# EAGLE design headstageNano (EAGLE 7.3.0)
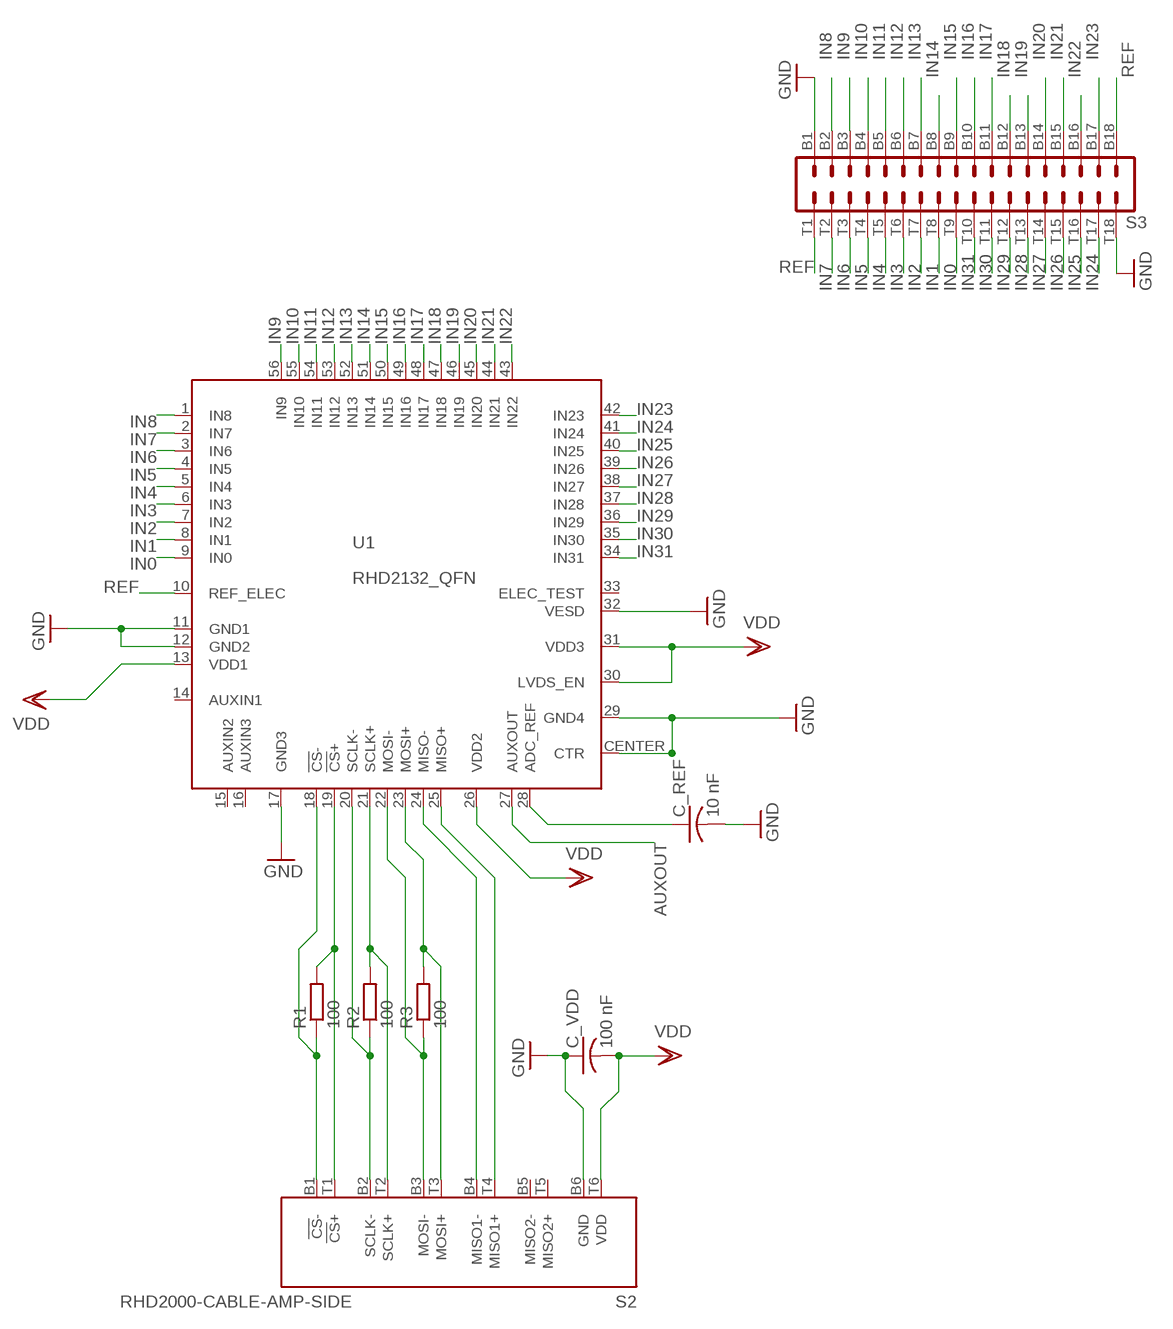
[diagram p0: schematic, sheet 1]

## Parts
C_REF  10 nF  C-USC0402K  [C0402K]
C_VDD  100 nF  C-USC0402K  [C0402K]
R1  100  R-EU_R0402  [R0402]
R2  100  R-EU_R0402  [R0402]
R3  100  R-EU_R0402  [R0402]
S2  RHD2000-CABLE-AMP-SIDE  [OMNETICS_PZN-12-AA]
S3  OMNETICS_A79025  [OMNETICS_A79025]
U1  RHD2132_QFN  [QFN56_8_X_8_LARGE]

## Nets
ADC_REF: C_REF.1 U1.28(ADC_REF)
AUXOUT: U1.27(AUXOUT)
CS+: R1.2 S2.T1(!CS!+) U1.19(!CS!+)
CS-: R1.1 S2.B1(!CS!-) U1.18(!CS!-)
GND: C_REF.2 C_VDD.1 S2.B6(GND) S3.B1 S3.T18 U1.11(GND1) U1.12(GND2) U1.17(GND3) U1.29(GND4) U1.32(VESD) U1.CENTER(CTR)
IN0: S3.T9 U1.9(IN0)
IN1: S3.T8 U1.8(IN1)
IN2: S3.T7 U1.7(IN2)
IN3: S3.T6 U1.6(IN3)
IN4: S3.T5 U1.5(IN4)
IN5: S3.T4 U1.4(IN5)
IN6: S3.T3 U1.3(IN6)
IN7: S3.T2 U1.2(IN7)
IN8: S3.B2 U1.1(IN8)
IN9: S3.B3 U1.56(IN9)
IN10: S3.B4 U1.55(IN10)
IN11: S3.B5 U1.54(IN11)
IN12: S3.B6 U1.53(IN12)
IN13: S3.B7 U1.52(IN13)
IN14: S3.B8 U1.51(IN14)
IN15: S3.B9 U1.50(IN15)
IN16: S3.B10 U1.49(IN16)
IN17: S3.B11 U1.48(IN17)
IN18: S3.B12 U1.47(IN18)
IN19: S3.B13 U1.46(IN19)
IN20: S3.B14 U1.45(IN20)
IN21: S3.B15 U1.44(IN21)
IN22: S3.B16 U1.43(IN22)
IN23: S3.B17 U1.42(IN23)
IN24: S3.T17 U1.41(IN24)
IN25: S3.T16 U1.40(IN25)
IN26: S3.T15 U1.39(IN26)
IN27: S3.T14 U1.38(IN27)
IN28: S3.T13 U1.37(IN28)
IN29: S3.T12 U1.36(IN29)
IN30: S3.T11 U1.35(IN30)
IN31: S3.T10 U1.34(IN31)
MISO1+: S2.T4(MISO1+) U1.25(MISO+)
MISO1-: S2.B4(MISO1-) U1.24(MISO-)
MOSI+: R3.2 S2.T3(MOSI+) U1.23(MOSI+)
MOSI-: R3.1 S2.B3(MOSI-) U1.22(MOSI-)
REF: S3.B18 S3.T1 U1.10(REF_ELEC)
SCLK+: R2.2 S2.T2(SCLK+) U1.21(SCLK+)
SCLK-: R2.1 S2.B2(SCLK-) U1.20(SCLK-)
VDD: C_VDD.2 S2.T6(VDD) U1.13(VDD1) U1.26(VDD2) U1.30(LVDS_EN) U1.31(VDD3)
Unconnected: S2.B5(MISO2-) S2.T5(MISO2+) U1.14(AUXIN1) U1.15(AUXIN2) U1.16(AUXIN3) U1.33(ELEC_TEST)

## Library data of the parts
C_REF C_VDD = resistor:C-US: CAPACITOR, American symbol
R1-R3 = resistor:R-EU_: RESISTOR, European symbol
S2 = RHD2000:RHD2000-CABLE-AMP-SIDE
S3 = RHD2000b:OMNETICS_A79025: Omnetics A79025 36-pin connector
U1 = RHD2000:RHD2132

## Board
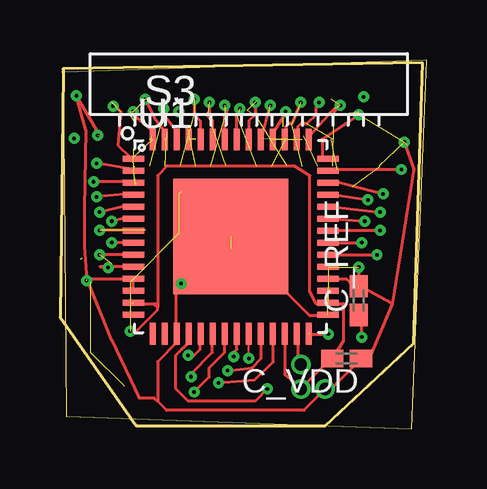
[diagram p1: board, top side]
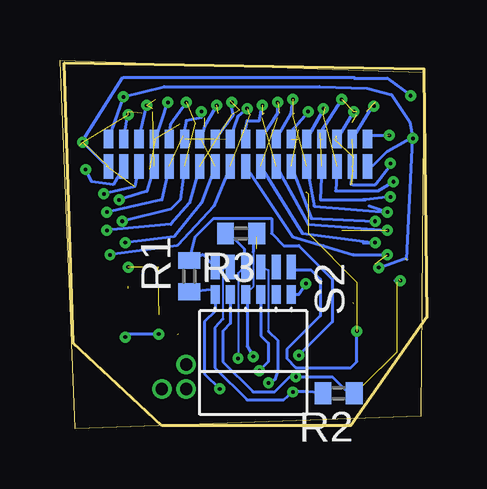
[diagram p2: board, bottom side, seen from below]

Size 15.29 x 15.36 mm. Coordinates in mm from the lower left corner, seen from the top.
Outline: 0.13,14.85 15.29,15.36 14.66,0 0.25,0.51 0.13,14.85
Outline: 0.13,14.85 0.13,14.99 15.11,15.24 14.73,3.56 11.05,0.13 3.18,0.13 0,4.63 0.13,14.85
Copper layers (1*16): Top 0.0178mm / dielectric 59mil / Bottom 0.0178mm
Design rules "default": minimum track width 5mil, minimum drill 10mil, track to track 5mil, track to pad 5mil, pad to pad 5mil, via to via 5mil, smd to smd 5mil, copper to edge 10mil, drill to drill 16mil, minimum pad ring 6mil, minimum via ring 6mil, stop-mask expansion 3mil, vias tented up to drill 0mil, thermal gap 10mil

### Footprints (pad centres in the part's own frame; a part is rotated, then mirrored left to right if it is on the bottom)
C0402K = smd 0.925 x 0.74: 1 -0.6,0; 2 0.6,0
R0402 = smd 0.7 x 0.9: 1 -0.65,0; 2 0.65,0
OMNETICS_PZN-12-AA = smd 0.381 x 0.762: B1 1.587,-1.016; B2 0.953,-1.016; B3 0.318,-1.016; B4 -0.318,-1.016; B5 -0.953,-1.016; B6 -1.587,-1.016 | smd 0.381 x 1.016: T1 1.587,-2.159; T2 0.953,-2.159; T3 0.318,-2.159; T4 -0.318,-2.159; T5 -0.953,-2.159; T6 -1.587,-2.159
OMNETICS_A79025 = smd 0.381 x 0.762 bottom: B1 -5.397,-1.016; B2 -4.763,-1.016; B3 -4.128,-1.016; B4 -3.493,-1.016; B5 -2.857,-1.016; B6 -2.223,-1.016; B7 -1.587,-1.016; B8 -0.953,-1.016; B9 -0.318,-1.016; B10 0.318,-1.016; B11 0.953,-1.016; B12 1.587,-1.016; B13 2.223,-1.016; B14 2.857,-1.016; B15 3.493,-1.016; B16 4.128,-1.016; B17 4.763,-1.016; B18 5.397,-1.016 | smd 0.381 x 1.016 bottom: T1 -5.397,-2.159; T2 -4.763,-2.159; T3 -4.128,-2.159; T4 -3.493,-2.159; T5 -2.857,-2.159; T6 -2.223,-2.159; T7 -1.587,-2.159; T8 -0.953,-2.159; T9 -0.318,-2.159; T10 0.318,-2.159; T11 0.953,-2.159; T12 1.587,-2.159; T13 2.223,-2.159; T14 2.857,-2.159; T15 3.493,-2.159; T16 4.128,-2.159; T17 4.763,-2.159; T18 5.397,-2.159
QFN56_8_X_8_LARGE = smd 0.9 x 0.25: 1 -4.05,3.25; 2 -4.05,2.75; 3 -4.05,2.25; 4 -4.05,1.75; 5 -4.05,1.25; 6 -4.05,0.75; 7 -4.05,0.25; 8 -4.05,-0.25; 9 -4.05,-0.75; 10 -4.05,-1.25; 11 -4.05,-1.75; 12 -4.05,-2.25; 13 -4.05,-2.75; 14 -4.05,-3.25; 29 4.05,-3.25; 30 4.05,-2.75; 31 4.05,-2.25; 32 4.05,-1.75; 33 4.05,-1.25; 34 4.05,-0.75; 35 4.05,-0.25; 36 4.05,0.25; 37 4.05,0.75; 38 4.05,1.25; 39 4.05,1.75; 40 4.05,2.25; 41 4.05,2.75; 42 4.05,3.25 | smd 0.25 x 0.9: 15 -3.25,-4.05; 16 -2.75,-4.05; 17 -2.25,-4.05; 18 -1.75,-4.05; 19 -1.25,-4.05; 20 -0.75,-4.05; 21 -0.25,-4.05; 22 0.25,-4.05; 23 0.75,-4.05; 24 1.25,-4.05; 25 1.75,-4.05; 26 2.25,-4.05; 27 2.75,-4.05; 28 3.25,-4.05; 43 3.25,4.05; 44 2.75,4.05; 45 2.25,4.05; 46 1.75,4.05; 47 1.25,4.05; 48 0.75,4.05; 49 0.25,4.05; 50 -0.25,4.05; 51 -0.75,4.05; 52 -1.25,4.05; 53 -1.75,4.05; 54 -2.25,4.05; 55 -2.75,4.05; 56 -3.25,4.05 | smd 4.8 x 4.8: CENTER 0,0

### Placement (x,y rotation side)
C_REF  12.45,5.33 90 top
C_VDD  11.94,2.92 180 top
R1  9.91,6.35 90 bottom
R2  3.68,1.47 180 bottom
R3  7.75,8.13 180 bottom
S2  7.24,4.57 180 bottom
S3  7.87,13.08 0 top
U1  7.11,8 0 top

### Tracks (layer width: path | path; a pad name or v marks a point on that pad's centre or on a via)
ADC_REF  (via drill 0.15)  (1 unrouted)
  Top 0.127: C_REF.1 12.61,4.73 12.45,4.7 12.7,4.7 12.57,4.57 v12.57,3.81 | 10.41,4.19 10.41,3.94 v11.18,3.94
  Bottom 0.127: v11.18,3.94 12.45,3.94 v12.57,3.81
AUXOUT  (via drill 0.51)
  Top 0.127: v10.03,2.67 9.91,2.67 9.91,3.56 9.86,3.6 U1.27
CS+  (via drill 0.15)
  Top 0.127: v5.33,3.05 5.59,3.05 5.84,3.3 5.84,3.93 U1.19
  Bottom 0.127: v5.33,3.05 3.94,4.45 3.94,6.22 5.33,7.62 5.97,7.62 6.48,8.13 6.48,8.76 8.89,8.76 9.65,8 R1.2 9.35,7.25 S2.T1
CS-  (via drill 0.15)
  Top 0.127: v8.64,1.65 8.13,1.14 5.33,1.14 4.83,1.65 4.83,3.05 5.08,3.3 5.33,3.54 U1.18
  Bottom 0.076: 8.84,5.83 S2.B1
  Bottom 0.127: 8.89,5.52 S2.B1 8.83,4.89 9.27,4.45 9.27,2.29 v8.64,1.65 | R1.1 8.84,5.83
GND  (via drill 0.15, 0.51)  (10 unrouted)
  Top 0.076: 11.3,1.65 12.45,2.79
  Top 0.127: 11.43,4.7 11.3,4.7 | 11.3,4.7 10.41,4.7 9.02,6.1 | 4.83,5.71 5.08,5.71 v5.04,6.04 | v5.04,6.04 5.59,6.22 5.33,6.22 7.11,7.49 | v5.04,6.04 4.95,5.84 | 4.95,5.84 4.83,5.71 | 13.84,5.21 12.66,5.84 C_REF.2 12.23,5.93 11.94,6.22 11.19,6.22 | 13.84,5.21 14.73,10.8 14.35,11.94 | 13.84,5.21 12.83,2.79 12.54,2.79 C_VDD.1 12.41,2.76 11.3,1.65 v11.05,1.65 10.16,0.76 4.45,0.76 4.06,1.14 | 4.06,1.14 3.94,1.27 3.3,1.27 2.16,3.68 1.14,6.22 3.05,6.22 3.05,5.75 U1.12 | 5.08,5.97 4.95,5.84 | 4.83,5.71 4.83,4.19 4.86,4.16 U1.17 4.86,3.59 4.06,2.79 4.06,1.14 | 11.19,6.22 11.18,6.22 | 11.19,6.22 U1.32 | U1.29 11.25,4.75 11.3,4.7 | 11.19,6.72 11.18,6.73 | 12.45,6.6 12.45,5.84 | v1.11,6.17 1.02,7.62 1.02,9.14 1.07,12.45 v0.69,13.87 1.65,12.19
  Bottom 0.127: 14.48,11.81 12.68,14.63 3.02,14.63 | S2.B6 5.33,5.59 v5.04,6.04 | v1.11,6.17 1.34,6.17 1.27,6.1 | S3.B1 2.32,12.22 v1.58,12.22
  other vias: 12.45,6.73
IN0  (via drill 0.15)  (1 unrouted)
  Top 0.127: v1.65,7.24 3.05,7.24 U1.9
  Bottom 0.127: S3.T9 5.59,8 4.32,7.62 U1.9 v1.65,7.24
IN1  (via drill 0.15)  (1 unrouted)
  Top 0.127: v2.16,7.75 U1.8 | v6.22,13.59 6.22,12.95
  Bottom 0.127: 2.67,7.75 v2.16,7.75 5.21,8.13 S3.T8
IN2  (via drill 0.15, 0.15 pad 0.15)  (2 unrouted)
  Top 0.127: v1.65,8.25 U1.7 | v6.86,13.46 6.98,13.34 6.86,12.95
  Bottom 0.127: S3.T7 4.95,8.51 v1.65,8.25
IN3  (via drill 0.15, 0.15 pad 0.15)  (1 unrouted)
  Top 0.127: v2.16,8.64 2.67,8.76 2.68,8.75 U1.6 | v4.95,13.21 5.08,12.95 5.08,12.7 5.33,12.45
  Bottom 0.127: S3.T6 4.83,8.76 v2.16,8.64
IN4  (via drill 0.15)  (1 unrouted)
  Top 0.127: v1.65,9.02 2.67,9.27 2.69,9.25 U1.5 | v5.59,13.72 5.59,13.08
  Bottom 0.127: 2.41,9.27 v1.65,9.02 4.7,9.27 S3.T5
IN5  (via drill 0.15)  (2 unrouted)
  Top 0.127: v1.52,9.65 2.92,9.78 2.95,9.75 U1.4 | v3.56,13.72 3.94,12.95 4.32,12.45
  Bottom 0.127: v1.52,9.65 2.55,9.54 | 2.55,9.54 2.67,9.53 | v3.56,13.72 4.45,12.32 | S3.T4 4.45,9.53 2.55,9.54
  other vias: 3.05,13.21
IN6  (via drill 0.15)  (1 unrouted)
  Top 0.127: v1.4,10.29 2.79,10.29 2.83,10.25 U1.3 | v4.32,13.34 4.32,13.08
  Bottom 0.127: S3.T3 3.81,9.91 2.03,9.91 v1.4,10.29
IN7  (via drill 0.15)  (2 unrouted)
  Top 0.127: v1.52,11.05 3.02,10.8 U1.2 | v2.21,13.44 2.54,13.21
  Bottom 0.127: S3.T2 3.18,10.16
IN8  (2 unrouted)
  Bottom 0.127: S3.B2 2.27,13.45 | 3.11,10.16 2.16,10.16 1.65,10.8
IN9  (8 unrouted)
  Top 0.127: U1.56 3.81,12.1 3.81,12.45 2.92,13.21 | 2.54,13.21 2.41,11.81 2.92,11.3 3.05,11.3
  Bottom 0.127: S3.B3 3.05,13.21
IN10  (1 unrouted)
IN11  (1 unrouted)
  Top 0.127: 4.32,13.08 4.83,12.45 4.83,12.09 U1.54
  Bottom 0.152: 4.25,13.4 S3.B5
IN12  (1 unrouted)
  Bottom 0.127: S3.B6 5.65,12.38 4.95,13.21
IN13  (2 unrouted)
  Top 0.127: 5.59,13.08 5.84,12.83 5.84,12.2 U1.52
  Bottom 0.127: S3.B7 5.65,13.14 5.59,13.72
IN14  (1 unrouted)
  Top 0.127: 6.16,13.14 6.1,13.08 6.35,12.83 6.35,12.06 U1.51
  Bottom 0.127: S3.B8 6.22,13.14 6.22,13.59
IN15  (2 unrouted)
  Top 0.127: 6.86,13.08 U1.50
  Bottom 0.127: S3.B9 7.62,12.13 7.49,12.83 6.98,12.83 6.86,13.46
IN16  (2 unrouted)
  Top 0.127: 7.37,13.08 U1.49
  Bottom 0.127: S3.B10 7.87,13.02 7.49,13.34
IN17  (2 unrouted)
  Top 0.127: 8.13,13.08 7.87,12.83 7.87,12.06 U1.48
  Bottom 0.127: S3.B11 8.07,13.08 8.19,13.65
IN18  (2 unrouted)
  Top 0.127: 8.76,13.46 8.64,13.08 8.38,12.07 U1.47
IN19  (1 unrouted)
IN20  (1 unrouted)
  Top 0.127: 9.65,12.7 9.53,12.7 9.4,12.57 9.4,12.09 U1.45
  Bottom 0.127: S3.B14 10.67,12.7 10.03,13.59
IN21  (1 unrouted)
  Top 0.127: U1.44 9.86,12.28 9.91,12.32 9.91,12.57 10.03,12.7 10.29,12.7 10.67,13.08 10.67,13.4
IN22  (2 unrouted)
  Top 0.127: U1.43 10.36,12.39 10.41,12.19 11.43,13.34 11.24,13.14
  Bottom 0.127: S3.B16 11.68,13.46
IN23  (2 unrouted)
  Top 0.127: 12.45,13.08 10.92,12.07 10.92,11.3 10.97,11.25 U1.42
  Bottom 0.127: S3.B17 12.45,13.21
IN24  (via drill 0.15)  (1 unrouted)
  Top 0.127: v14.22,10.8 11.56,10.8 11.51,10.75 U1.41 | 10.8,13.72 v10.8,13.59
  Bottom 0.127: 11.3,12.07 v10.8,13.59 | S3.T17 13.08,10.16 13.97,10.29 v14.22,10.8
IN25  (via drill 0.15)  (2 unrouted)
  Top 0.127: v13.46,9.78 11.56,10.29 11.52,10.25 U1.40
  Bottom 0.127: v14.35,11.94 13.34,10.92 | S3.T16 12.17,10.09 v13.46,9.78
  other vias: 12.45,13.08
IN26  (via drill 0.15)  (1 unrouted)
  Top 0.127: v12.83,9.53 11.19,9.78 U1.39 | v11.68,13.46 11.43,13.21
  Bottom 0.127: S3.T15 11.67,9.88 v12.83,9.53
IN27  (via drill 0.15)  (1 unrouted)
  Top 0.127: v13.34,9.02 11.18,9.27 U1.38
  Bottom 0.127: v9.4,13.21 9.4,12.95 10.03,12.83 10.16,12.19 10.03,12.19 | S3.T14 11.05,9.53 v13.34,9.02
IN28  (via drill 0.15)  (1 unrouted)
  Top 0.127: v12.7,8.64 11.17,8.76 U1.37 | v10.03,13.59 9.65,12.7
  Bottom 0.127: S3.T13 10.29,9.53 10.67,9.14 v12.7,8.64
IN29  (via drill 0.15)  (1 unrouted)
  Top 0.127: v13.34,8.25 U1.36 | v8.13,13.59 8.13,13.08
  Bottom 0.127: S3.T12 9.91,9.4 10.67,8.51 v13.34,8.25
IN30  (via drill 0.15)  (2 unrouted)
  Top 0.127: v12.57,7.75 U1.35 | 8.89,12.32 9.27,12.95 9.4,13.21
  Bottom 0.127: v8.76,13.46 9.27,12.57 9.4,12.07 | S3.T11 9.4,9.4 10.54,8 v12.57,7.75
IN31  (via drill 0.15)  (1 unrouted)
  Top 0.127: v13.21,7.24 11.43,7.24 11.42,7.25 U1.34 | v7.49,13.34 7.37,13.08
  Bottom 0.127: S3.T10 8.89,9.27 10.41,7.62 v13.21,7.24
MISO1+  (via drill 0.15)
  Top 0.076: 8.89,3.56 U1.25
  Top 0.127: v6.6,1.91 8.11,2.03 8.89,2.78 8.89,3.56
  Bottom 0.076: S2.T4 6.86,6.73 6.6,6.6 6.6,4.06
  Bottom 0.127: 6.6,4.06 6.22,3.68 6.22,2.41 6.35,2.03 v6.6,1.91
MISO1-  (via drill 0.15)
  Top 0.127: v6.98,2.41 8,2.54 8.38,2.92 8.38,3.3 U1.24
  Bottom 0.127: S2.B4 6.92,3.87 6.6,3.56 6.6,2.79 v6.98,2.41
MOSI+  (via drill 0.15)
  Top 0.076: v7.87,2.92 7.87,3.81
  Top 0.127: 7.87,3.81 7.87,3.94 U1.23
  Bottom 0.076: 7.49,6.6 7.75,6.6 7.87,6.48 v7.87,2.92 | 7.62,6.79 S2.T3
  Bottom 0.127: S2.T3 7.49,6.6 | R3.2 8.25,8.13 7.62,7.49 7.62,6.79
MOSI-  (via drill 0.15)
  Top 0.076: 7.37,3.89 7.37,3.81
  Top 0.127: v7.24,3 7.24,3.18 7.37,3.3 7.37,3.89 7.36,3.89 U1.22
  Bottom 0.076: R3.1 7.22,8.02 | 7.24,7.37 7.24,5.91 S2.B3
  Bottom 0.127: S2.B3 7.62,5.52 7.49,5.52 7.49,3.43 v7.24,3 | 7.22,8.02 7.24,7.37
N$1
  Bottom 0.127: 3.05,14.61 1.65,14.61 0.64,13.84
N$2  (2 unrouted)
REF  (via drill 0.15)  (1 unrouted)
  Top 0.127: U1.10 1.67,6.75 v2.01,6.71
  Bottom 0.127: v2.01,6.71 0.91,7.09 | 0.84,7.04 v0.58,12.09 | v0.58,12.09 0.71,12.78 1.47,13.92 2.49,14.17 4.47,14.25 10.95,14.25 v12.65,13.82 S3.B18 | S3.T1 2.29,10.92 1.65,11.56 0.51,12.19 v0.58,12.09
SCLK+  (via drill 0.15)
  Top 0.076: 6.86,3.56 U1.21
  Top 0.127: v5.59,1.52 6.22,2.16 6.22,2.54 6.86,3.18 6.86,3.56
  Bottom 0.076: S2.T2 8.38,6.73 8.51,6.6 8.51,4.57
  Bottom 0.127: 8.51,4.57 8.84,4.19 8.84,2.54 7.49,1.19 5.97,1.19 v5.59,1.52 4.95,1.52 R2.2
SCLK-  (via drill 0.15)
  Top 0.127: v5.46,2.16 5.46,2.29 6.35,3.18 6.35,3.81 6.36,3.82 U1.20
  Bottom 0.127: S2.B2 8.19,4.38 8.51,4.06 8.51,2.79 7.24,1.52 6.35,1.52 5.71,2.16 v5.46,2.16 3.94,2.16 3.25,1.48 R2.1
VDD  (via drill 0.15, 0.51)  (5 unrouted)
  Top 0.127: 3.05,5.21 3.91,5.21 | v2.92,4.06 3.18,4.06 4.06,4.95 4.06,5.05 | U1.26 9.36,2.25 9.78,1.91 v10.03,1.65 11.3,2.92 C_VDD.2 11.81,3.65 11.81,5.21 11.12,5.21 | 11.12,5.21 10.67,5.21 10.41,5.71 10.41,10.54 9.78,10.92 4.45,10.92 4.06,10.54 4.06,5.21 | 11.12,5.21 U1.30 U1.31 | 4.06,5.21 4.06,5.05 | 4.06,5.05 3.91,5.21 | 3.91,5.21 4.06,5.21
  Bottom 0.076: 5.65,7.18 5.65,6.79
  Bottom 0.127: 5.65,7.18 S2.T6 5.52,6.6 4.83,6.6 4.45,6.22 4.45,4.7 5.84,3.3 5.84,2.92 5.46,2.54 3.18,2.54 2.92,2.79 v2.92,4.06

### Text on the board
tDocu: open-ephys | .org
bDocu: 32ch headstage | open-ephys.org | mini | rev 2.1 omnetics